# EAGLE schematic rf_test (EAGLE 5.12)

## Sheet 1 of 4
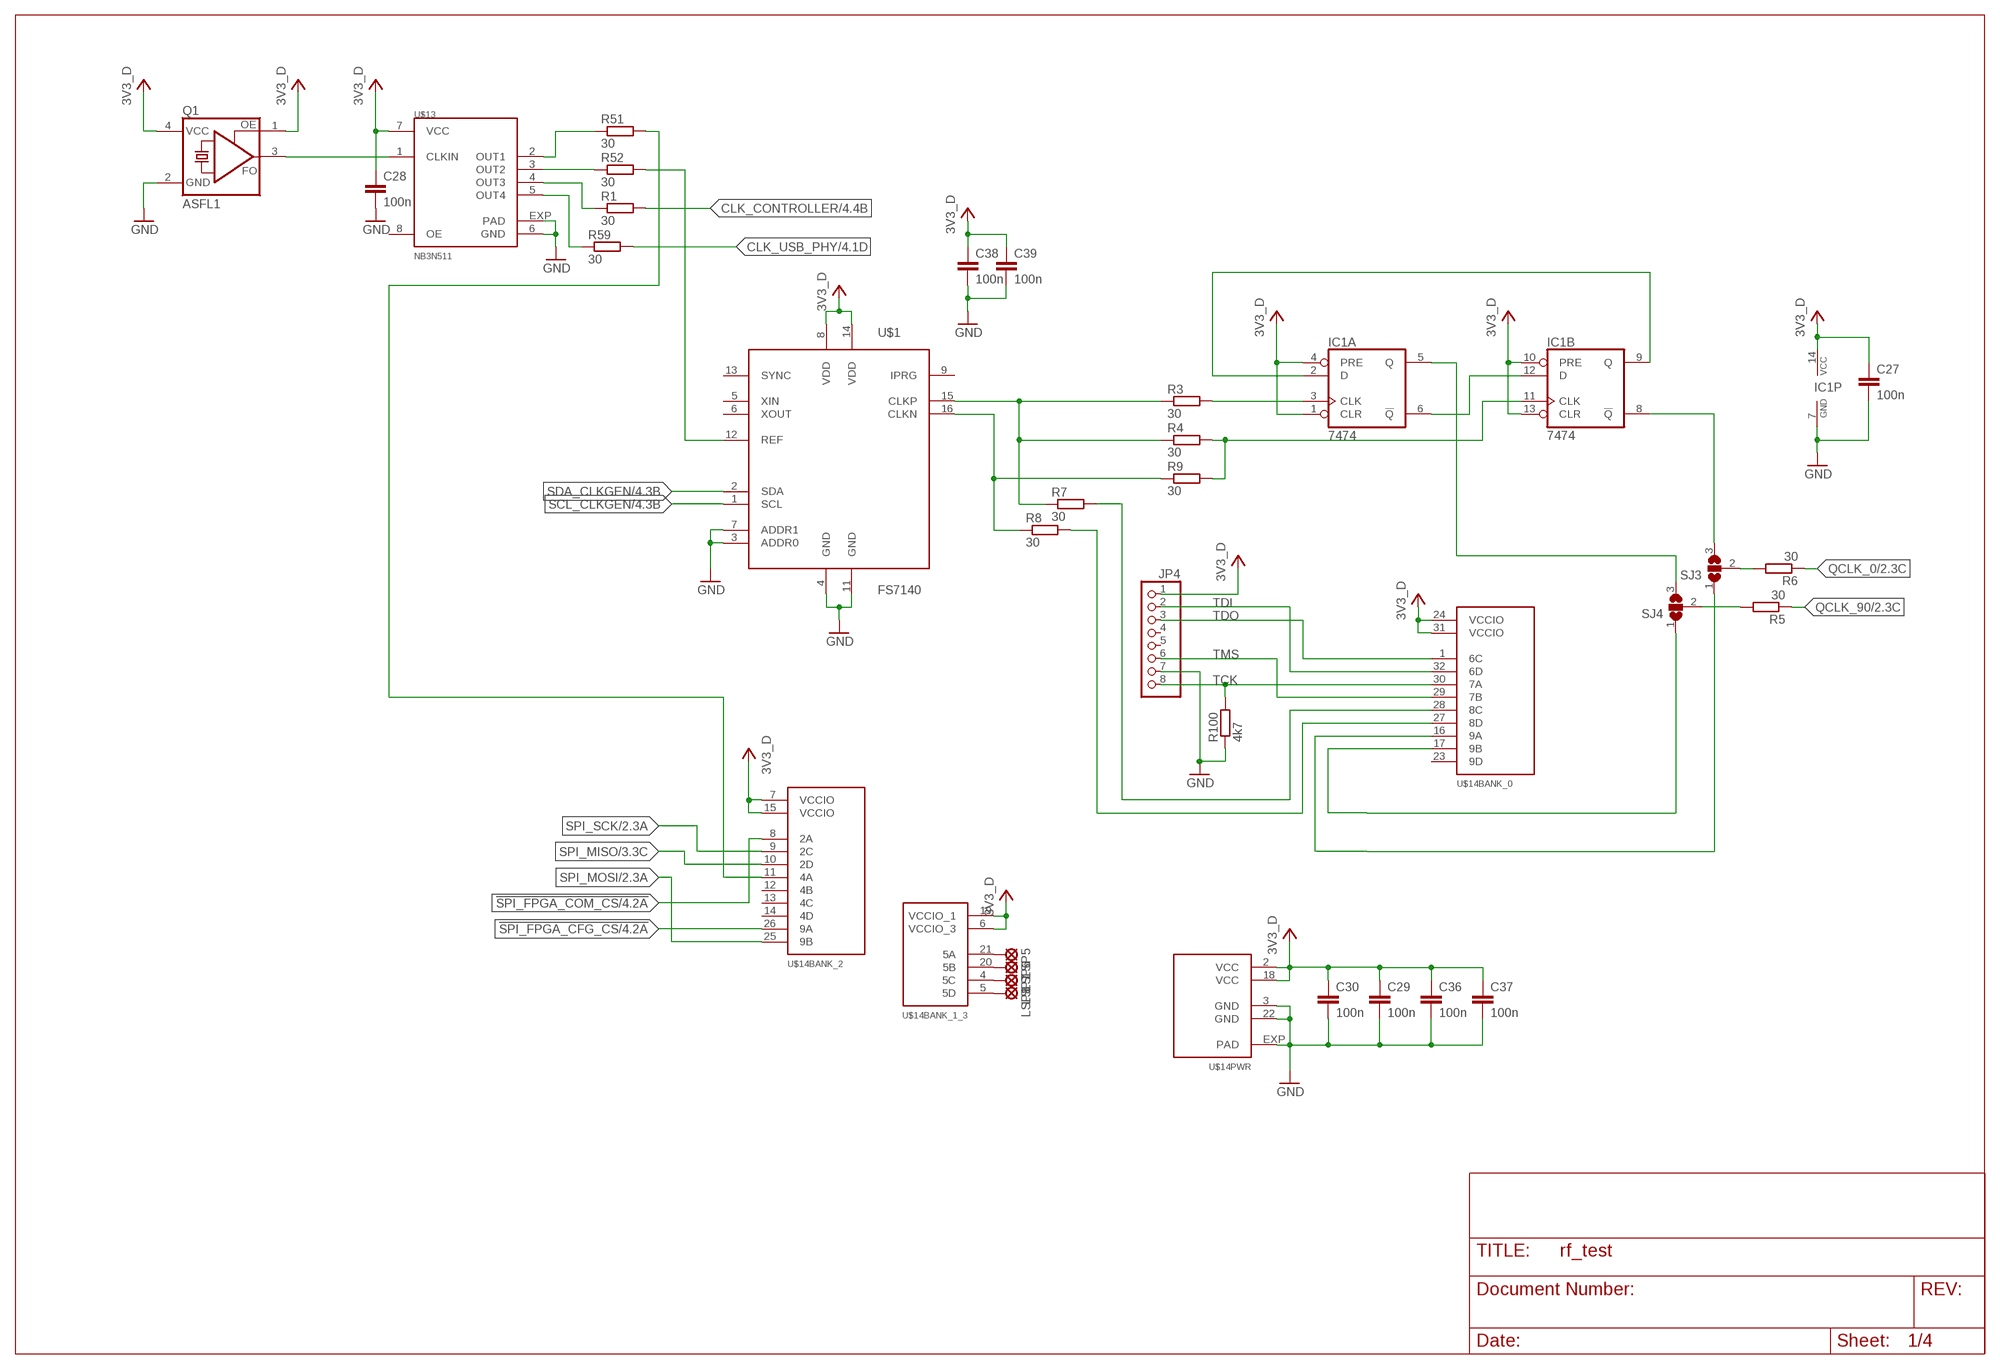
[diagram p0: schematic, sheet 1]

### Parts
C27  100n  C-EUC0402  [C0402]
C28  100n  C-EUC0402  [C0402]
C29  100n  C-EUC0402  [C0402]
C30  100n  C-EUC0402  [C0402]
C36  100n  C-EUC0402  [C0402]
C37  100n  C-EUC0402  [C0402]
C38  100n  C-EUC0402  [C0402]
C39  100n  C-EUC0402  [C0402]
IC1  7474  [TSSOP14]
JP4  PINHD-1X8  [1X08]
LSP5  LSP10  [LSP10]
LSP6  LSP10  [LSP10]
LSP7  LSP10  [LSP10]
LSP8  LSP10  [LSP10]
Q1  ASFL1  [ASEMB]
R1  30  R-EU_R0603  [R0603]
R3  30  R-EU_R0603  [R0603]
R4  30  R-EU_R0603  [R0603]
R5  30  R-EU_R0603  [R0603]
R6  30  R-EU_R0603  [R0603]
R7  30  R-EU_R0603  [R0603]
R8  30  R-EU_R0603  [R0603]
R9  30  R-EU_R0603  [R0603]
R51  30  R-EU_R0603  [R0603]
R52  30  R-EU_R0603  [R0603]
R59  30  R-EU_R0603  [R0603]
R100  4k7  R-EU_R0603  [R0603]
SJ3  SJ2W0402  [SJ_2_0402]
SJ4  SJ2W0402  [SJ_2_0402]
U$1  FS7140  [TSSOP16]
U$13  NB3N511  [DFN8-3X3]
U$14  X02_256  [HVQFN32]

### Nets
3V3_D: C27.1 C28.1 C29.1 C30.1 C36.1 C37.1 C38.1 C39.1 IC1.1(A:CLR) IC1.4(A:PRE) IC1.10(B:PRE) IC1.13(B:CLR) IC1.14(P:VCC) JP4.1 Q1.1(OE) Q1.4(VCC) U$1.8(VDD) U$1.14(VDD) U$13.7(VCC) U$14.2(PWR:VCC) U$14.6(BANK_1_3:VCCIO_3) U$14.7(BANK_2:VCCIO) U$14.15(BANK_2:VCCIO) U$14.18(PWR:VCC) U$14.19(BANK_1_3:VCCIO_1) U$14.24(BANK_0:VCCIO) U$14.31(BANK_0:VCCIO) ; also sheet 2,3,4
!SPI_FPGA_CFG_CS: U$14.26(BANK_2:9A) ; also sheet 4
!SPI_FPGA_COM_CS: U$14.8(BANK_2:2A) ; also sheet 4
CLK_CLKGEN: R52.2 U$1.12(REF)
CLK_CONTROLLER: R1.2 ; also sheet 4
CLK_OSC: Q1.3(FO) U$13.1(CLKIN)
CLK_USB_PHY: R59.2 ; also sheet 4
CLKN: R8.2 U$14.27(BANK_0:8D)
CLKN_R: R8.1 R9.1 U$1.16(CLKN)
CLKP_1: IC1.3(A:CLK) R3.2
CLKP_2: IC1.11(B:CLK) R4.2 R9.2
CLKP_3: R7.2 U$14.28(BANK_0:8C)
CLKP_R: R3.1 R4.1 R7.1 U$1.15(CLKP)
FF_FEEDBACK: IC1.2(A:D) IC1.9(B:Q)
FF_FEEDFORWARD: IC1.6(A:!Q) IC1.12(B:D)
FGA_CLK: R51.2 U$14.11(BANK_2:4A)
GND: C27.2 C28.2 C29.2 C30.2 C36.2 C37.2 C38.2 C39.2 IC1.7(P:GND) JP4.7 Q1.2(GND) R100.1 U$1.3(ADDR0) U$1.4(GND) U$1.7(ADDR1) U$1.11(GND) U$13.6(GND) U$13.EXP(PAD) U$14.3(PWR:GND) U$14.22(PWR:GND) U$14.EXP(PWR:PAD) ; also sheet 2,3,4
N$3: R6.2 SJ3.2
N$5: R5.2 SJ4.2
N$7: R1.1 U$13.4(OUT3)
N$15: R51.1 U$13.2(OUT1)
N$16: R52.1 U$13.3(OUT2)
N$25: LSP5.MP U$14.21(BANK_1_3:5A)
N$27: R59.1 U$13.5(OUT4)
N$41: LSP6.MP U$14.20(BANK_1_3:5B)
N$42: LSP7.MP U$14.4(BANK_1_3:5C)
N$43: LSP8.MP U$14.5(BANK_1_3:5D)
QCLK_0: R6.1 ; also sheet 2
QCLK_90: R5.1 ; also sheet 2
QCLK_IR_FF: IC1.5(A:Q) SJ4.3
QCLK_IR_FPGA: SJ4.1 U$14.17(BANK_0:9B)
QCLK_QR_FF: IC1.8(B:!Q) SJ3.3
QCLK_QR_FPGA: SJ3.1 U$14.16(BANK_0:9A)
SCL_CLKGEN: U$1.1(SCL) ; also sheet 4
SDA_CLKGEN: U$1.2(SDA) ; also sheet 4
SPI_MISO: U$14.10(BANK_2:2D) ; also sheet 3,4
SPI_MOSI: U$14.25(BANK_2:9B) ; also sheet 2,3,4
SPI_SCK: U$14.9(BANK_2:2C) ; also sheet 2,3,4
TCK: JP4.8 R100.2 U$14.30(BANK_0:7A)
TDI: JP4.2 U$14.32(BANK_0:6D)
TDO: JP4.3 U$14.1(BANK_0:6C)
TMS: JP4.6 U$14.29(BANK_0:7B)
Unconnected: JP4.4 JP4.5 U$1.5(XIN) U$1.6(XOUT) U$1.9(IPRG) U$1.13(SYNC) U$13.8(OE) U$14.12(BANK_2:4B) U$14.13(BANK_2:4C) U$14.14(BANK_2:4D) U$14.23(BANK_0:9D)

## Sheet 2 of 4
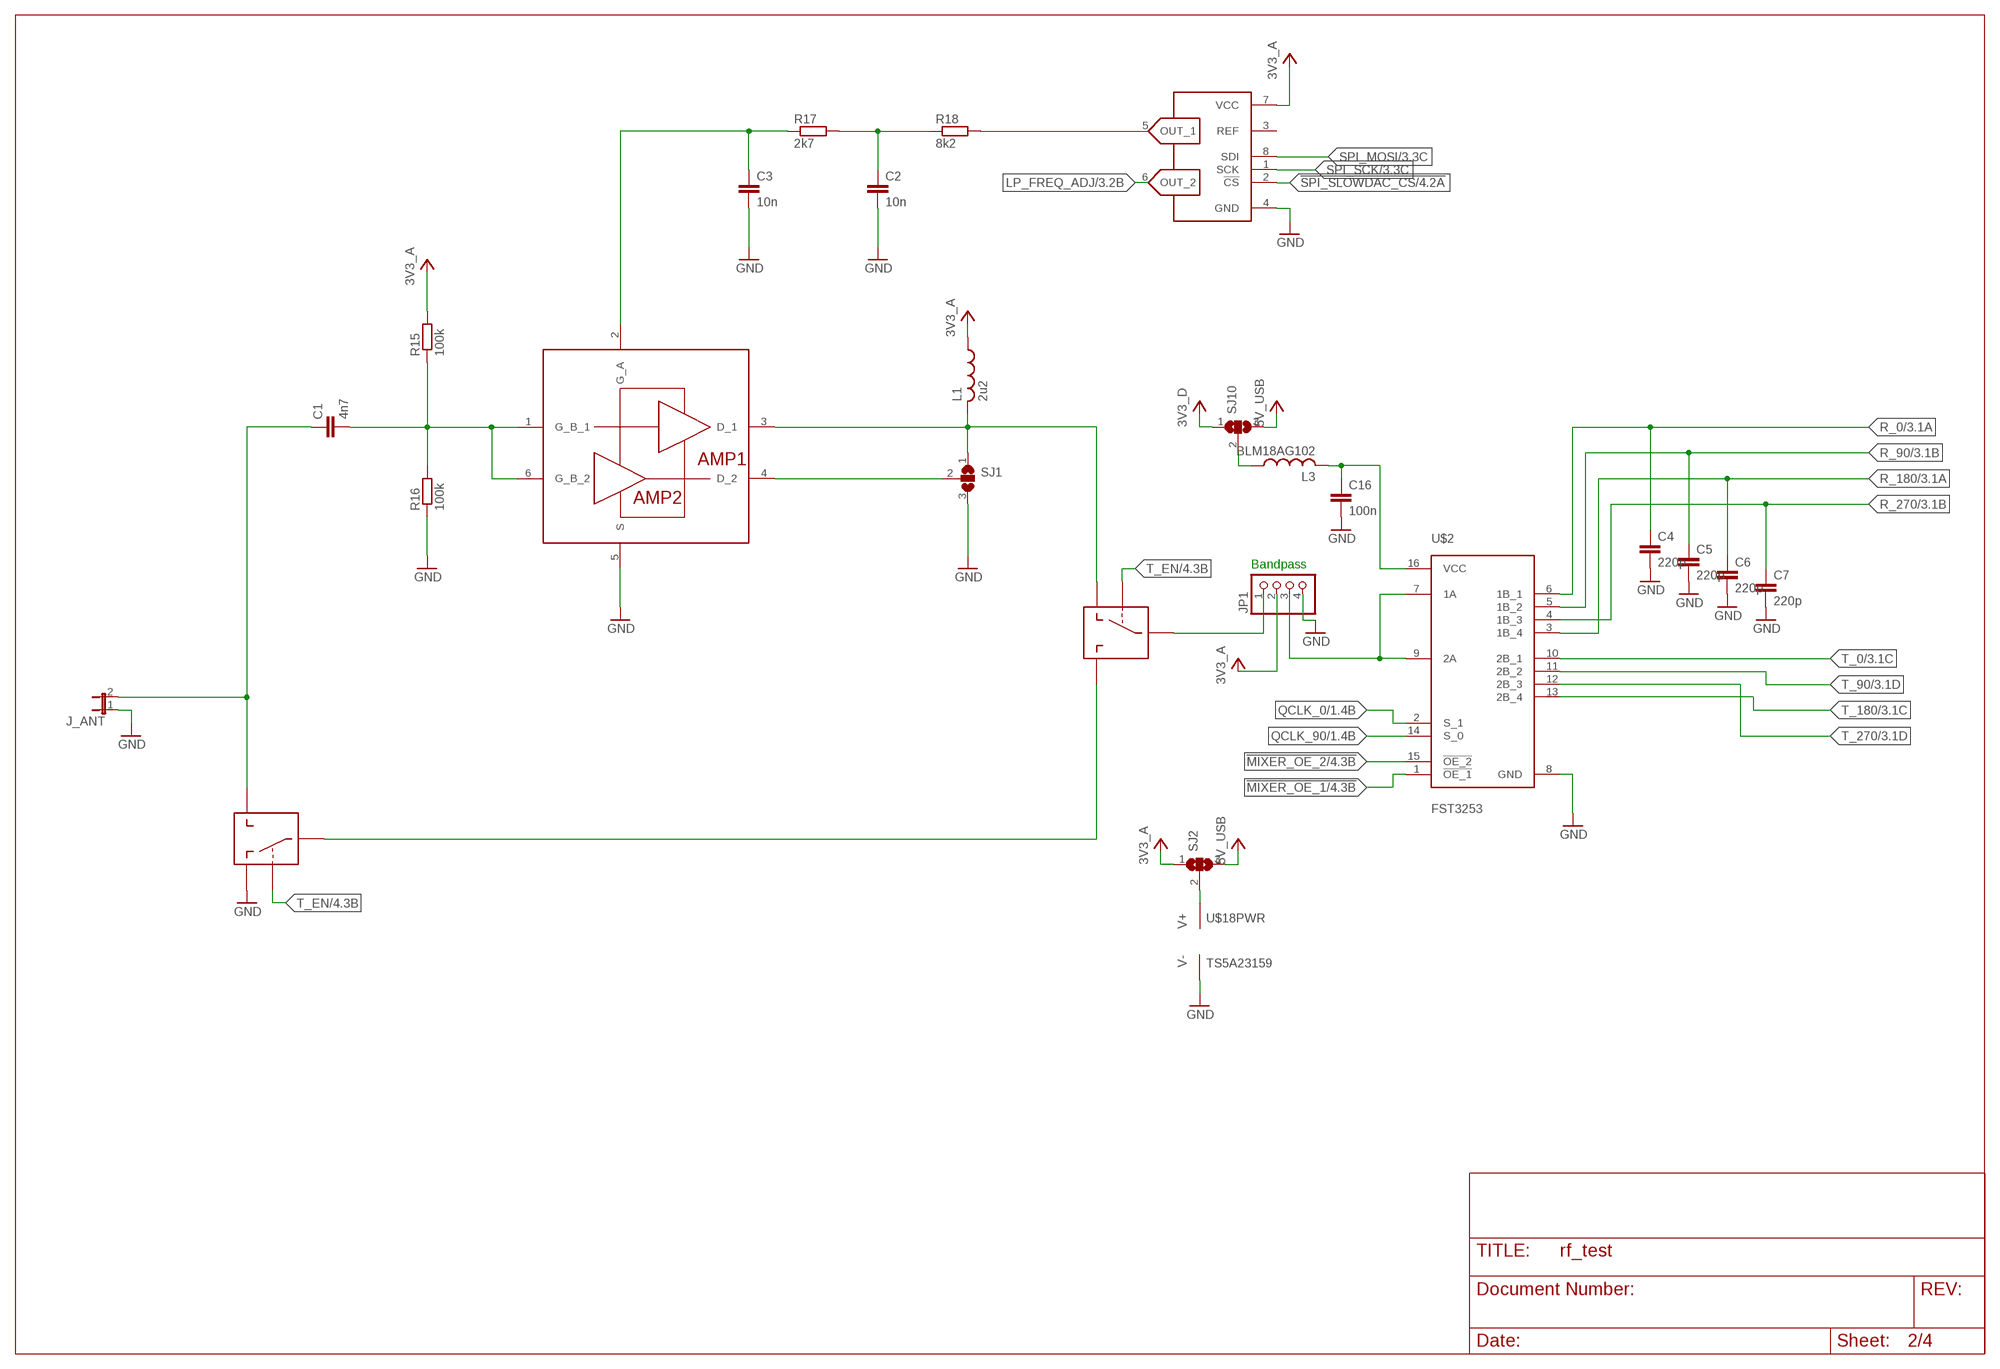
[diagram p1: schematic, sheet 2]

### Parts
C1  4n7  C-EUC0402  [C0402]
C2  10n  C-EUC0402  [C0402]
C3  10n  C-EUC0402  [C0402]
C4  220p  C-EUC0402  [C0402]
C5  220p  C-EUC0402  [C0402]
C6  220p  C-EUC0402  [C0402]
C7  220p  C-EUC0402  [C0402]
C16  100n  C-EUC0402  [C0402]
J_ANT  JP1E  [JP1]
JP1  PINHD-1X4  [1X04]
L1  2u2  L_US_1008  [L1008]
L3  BLM18AG102  L_US_BLM18  [L0603]
R15  100k  R-EU_R0603  [R0603]
R16  100k  R-EU_R0603  [R0603]
R17  2k7  R-EU_R0603  [R0603]
R18  8k2  R-EU_R0603  [R0603]
SJ1  SJ2W0402  [SJ_2_0402]
SJ2  SJ2W0402  [SJ_2_0402]
SJ10  SJ2W0402  [SJ_2_0402]
U$2  FST3253  [TSSOP16]
U$3  BF1102  [SOT363_INFINEON]
U$6  LTC2632  [TSOT23-8]
U$18  TS5A23159  [R-PUQFN-N10]

### Nets
3V3_A: JP1.2 L1.1 R15.2 SJ2.1 U$6.7(VCC) ; also sheet 3,4
3V3_D: SJ10.1 ; also sheet 1,3,4
5V_USB: SJ2.3 SJ10.3 ; also sheet 4
!MIXER_OE_1: U$2.1(!OE_1) ; also sheet 4
!MIXER_OE_2: U$2.15(!OE_2) ; also sheet 4
!SPI_SLOWDAC_CS: U$6.2(!CS) ; also sheet 4
AGC_FILTER: C2.1 R17.2 R18.1
BP_ANT: JP1.1 U$18.10(SW1:COMMON)
BP_MIXER: JP1.3 U$2.7(1A) U$2.9(2A)
GND: C2.2 C3.2 C4.2 C5.2 C6.2 C7.2 C16.2 J_ANT.1 JP1.4 R16.1 SJ1.3 U$2.8(GND) U$3.5(S) U$6.4(GND) U$18.3(PWR:GND) U$18.7(SW2:CLOSED) ; also sheet 1,3,4
LNA_G2: C3.1 R17.1 U$3.2(G_A)
LP_FREQ_ADJ: U$6.6(OUT_2) ; also sheet 3
QCLK_0: U$2.2(S_1) ; also sheet 1
QCLK_90: U$2.14(S_0) ; also sheet 1
R_0: C4.1 U$2.6(1B_1) ; also sheet 3
R_90: C5.1 U$2.5(1B_2) ; also sheet 3
R_180: C6.1 U$2.3(1B_4) ; also sheet 3
R_270: C7.1 U$2.4(1B_3) ; also sheet 3
R_AMPLIFIED: L1.2 SJ1.1 U$3.3(D_1) U$18.9(SW1:CLOSED)
R_AMPLIFIED_2: SJ1.2 U$3.4(D_2)
R_ANT: C1.1 J_ANT.2 U$18.4(SW2:OPEN)
R_ANT_AGC: C1.2 R15.1 R16.2 U$3.1(G_B_1) U$3.6(G_B_2)
SPI_MOSI: U$6.8(SDI) ; also sheet 1,3,4
SPI_SCK: U$6.1(SCK) ; also sheet 1,3,4
T_0: U$2.10(2B_1) ; also sheet 3
T_90: U$2.11(2B_2) ; also sheet 3
T_180: U$2.13(2B_4) ; also sheet 3
T_270: U$2.12(2B_3) ; also sheet 3
T_ANT: U$18.2(SW1:OPEN) U$18.6(SW2:COMMON)
T_EN: U$18.1(SW1:CTL) U$18.5(SW2:CTL) ; also sheet 4
VAGC: R18.2 U$6.5(OUT_1)
VCC_FILTER_UNFILT: L3.1 SJ10.2
VCC_MIXER_FILTERED: C16.1 L3.2 U$2.16(VCC)
VCC_RT_SWITCH: SJ2.2 U$18.8(PWR:V+)
Unconnected: U$6.3(REF)

### Notes on the sheet
- Bandpass

## Sheet 3 of 4
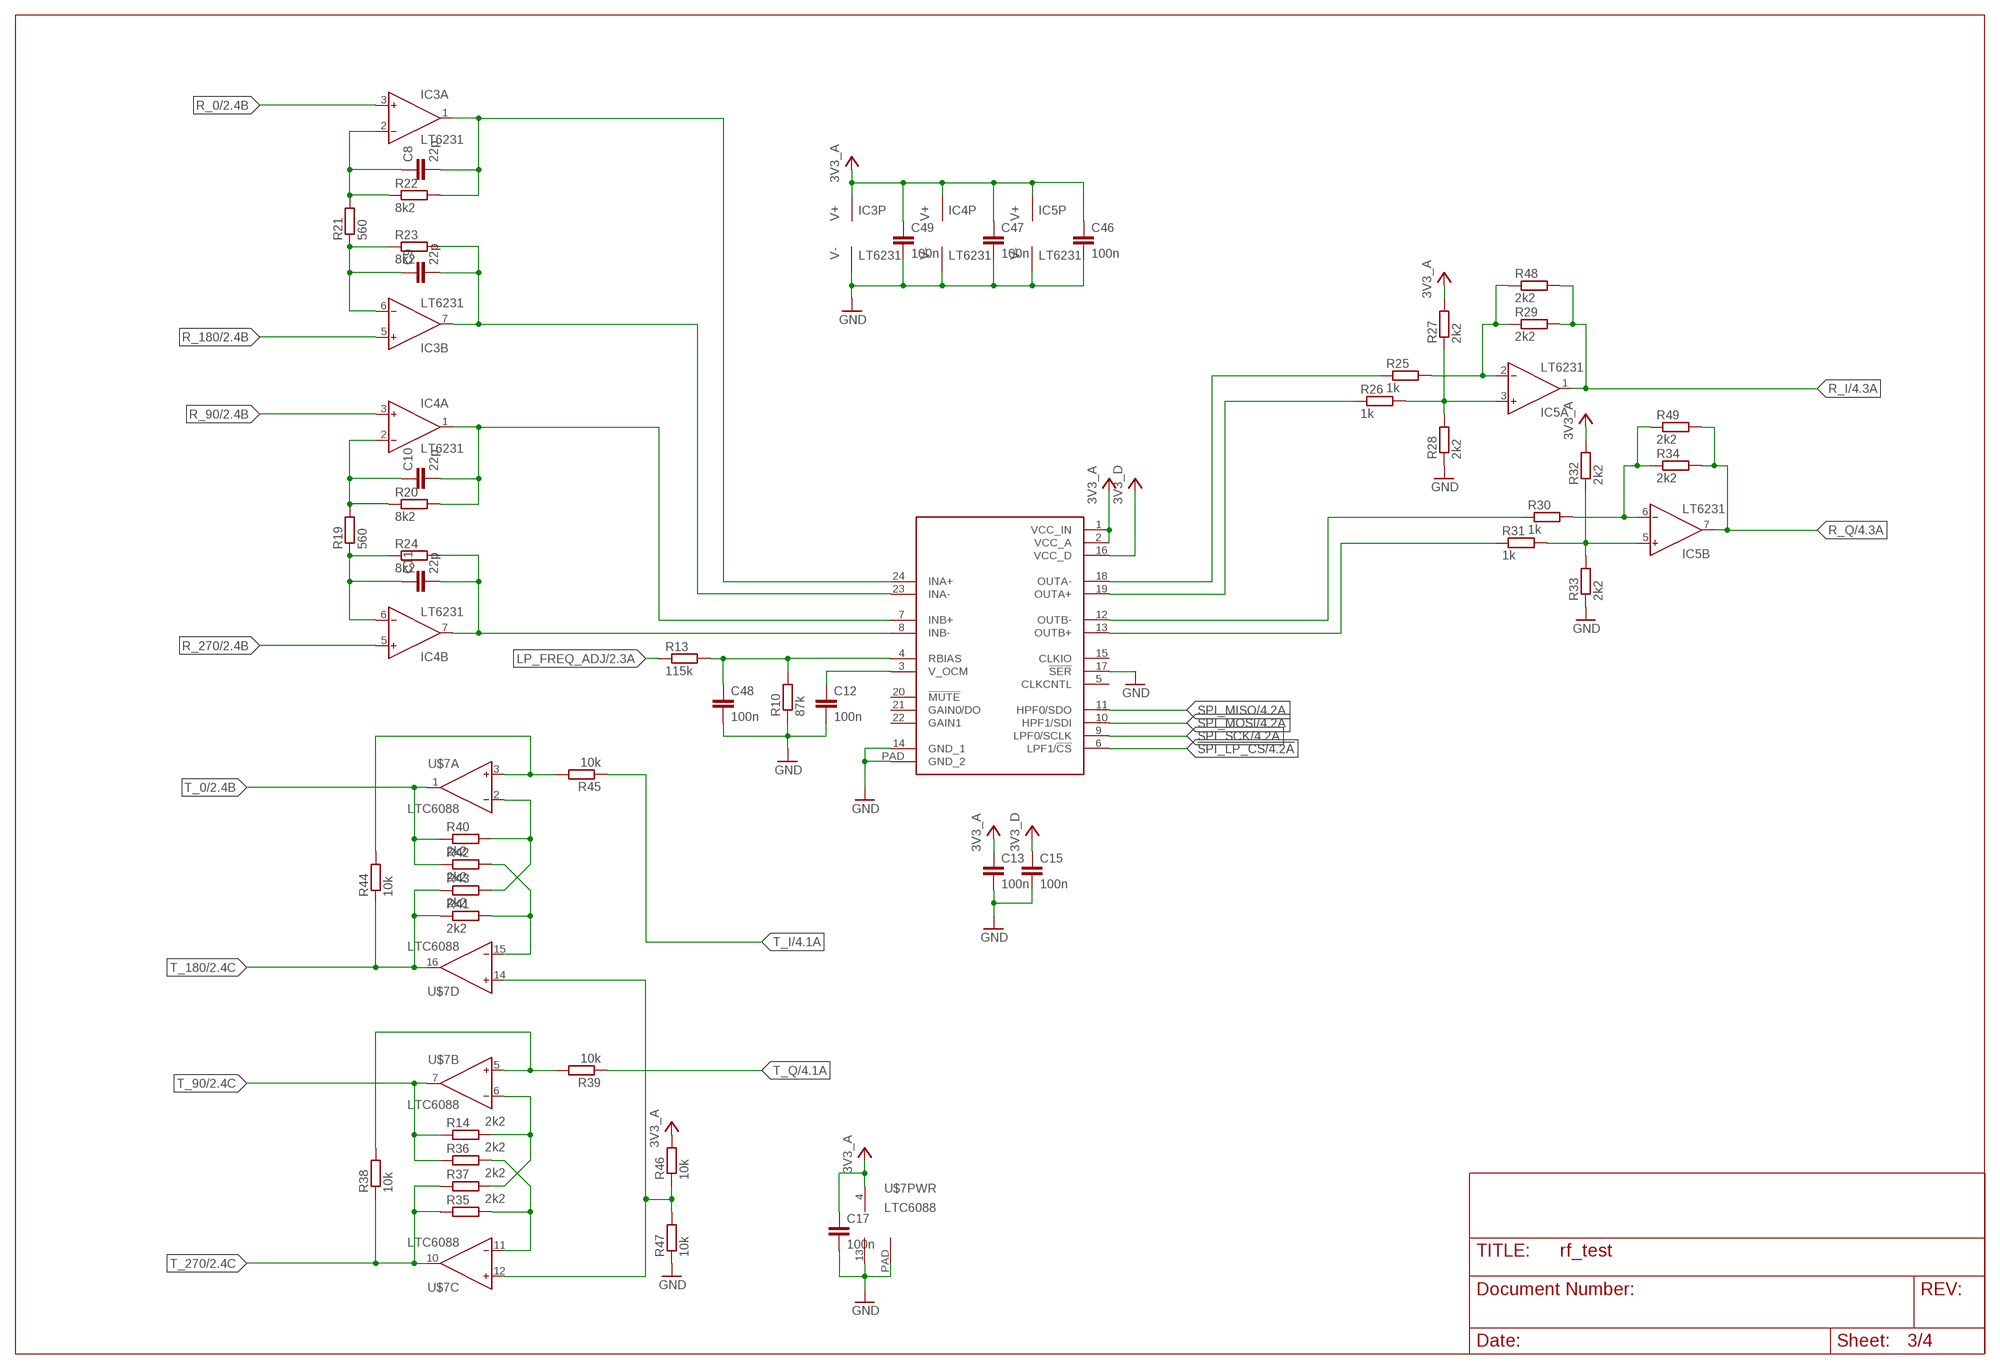
[diagram p2: schematic, sheet 3]

### Parts
C8  22p  C-EUC0402  [C0402]
C9  22p  C-EUC0402  [C0402]
C10  22p  C-EUC0402  [C0402]
C11  22p  C-EUC0402  [C0402]
C12  100n  C-EUC0402  [C0402]
C13  100n  C-EUC0402  [C0402]
C15  100n  C-EUC0402  [C0402]
C17  100n  C-EUC0402  [C0402]
C46  100n  C-EUC0402  [C0402]
C47  100n  C-EUC0402  [C0402]
C48  100n  C-EUC0402  [C0402]
C49  100n  C-EUC0402  [C0402]
IC3  LT6231  [DFN8-3X3]
IC4  LT6231  [DFN8-3X3]
IC5  LT6231  [DFN8-3X3]
R10  87k  R-EU_R0603  [R0603]
R13  115k  R-EU_R0603  [R0603]
R14  2k2  R-EU_R0603  [R0603]
R19  560  R-EU_R0603  [R0603]
R20  8k2  R-EU_R0603  [R0603]
R21  560  R-EU_R0603  [R0603]
R22  8k2  R-EU_R0603  [R0603]
R23  8k2  R-EU_R0603  [R0603]
R24  8k2  R-EU_R0603  [R0603]
R25  1k  R-EU_R0603  [R0603]
R26  1k  R-EU_R0603  [R0603]
R27  2k2  R-EU_R0603  [R0603]
R28  2k2  R-EU_R0603  [R0603]
R29  2k2  R-EU_R0603  [R0603]
R30  1k  R-EU_R0603  [R0603]
R31  1k  R-EU_R0603  [R0603]
R32  2k2  R-EU_R0603  [R0603]
R33  2k2  R-EU_R0603  [R0603]
R34  2k2  R-EU_R0603  [R0603]
R35  2k2  R-EU_R0603  [R0603]
R36  2k2  R-EU_R0603  [R0603]
R37  2k2  R-EU_R0603  [R0603]
R38  10k  R-EU_R0603  [R0603]
R39  10k  R-EU_R0603  [R0603]
R40  2k2  R-EU_R0603  [R0603]
R41  2k2  R-EU_R0603  [R0603]
R42  2k2  R-EU_R0603  [R0603]
R43  2k2  R-EU_R0603  [R0603]
R44  10k  R-EU_R0603  [R0603]
R45  10k  R-EU_R0603  [R0603]
R46  10k  R-EU_R0603  [R0603]
R47  10k  R-EU_R0603  [R0603]
R48  2k2  R-EU_R0603  [R0603]
R49  2k2  R-EU_R0603  [R0603]
U$4  LTC6602  [QFN24_4X4MM]
U$7  LTC6088  [DFN16_5X3MM]

### Nets
3V3_A: C13.1 C17.1 C46.1 C47.1 C49.1 IC3.8(P:V+) IC4.8(P:V+) IC5.8(P:V+) R27.2 R32.2 R46.2 U$4.1(VCC_IN) U$4.2(VCC_A) U$7.4(PWR:V+) ; also sheet 2,4
3V3_D: C15.1 U$4.16(VCC_D) ; also sheet 1,2,4
!SPI_LP_CS: U$4.6(LPF1/!CS) ; also sheet 4
BP_VOCM: C12.1 U$4.3(V_OCM)
GND: C12.2 C13.2 C15.2 C17.2 C46.2 C47.2 C48.2 C49.2 IC3.4(P:GND) IC4.4(P:GND) IC5.4(P:GND) R10.1 R28.1 R33.1 R47.1 U$4.14(GND_1) U$4.17(!SER) U$4.PAD(GND_2) U$7.13(PWR:V-) U$7.PAD(PWR:PAD) ; also sheet 1,2,4
I_BIAS: IC5.3(A:IN+) R26.2 R27.1 R28.2
I_FEEDBACK: IC5.2(A:IN-) R25.2 R29.1 R48.1
I_NEG: C9.2 IC3.7(B:OUT) R23.2 U$4.23(INA-)
I_NEG_FEEDBACK: C9.1 IC3.6(B:IN-) R21.1 R23.1
I_NEG_FILTERED: R26.1 U$4.19(OUTA+)
I_POS: C8.2 IC3.1(A:OUT) R22.2 U$4.24(INA+)
I_POS_FEEDACK: C8.1 IC3.2(A:IN-) R21.2 R22.1
I_POS_FILTERED: R25.1 U$4.18(OUTA-)
LP_FREQ_ADJ: R13.1 ; also sheet 2
LP_RBIAS: C48.1 R10.2 R13.2 U$4.4(RBIAS)
N$4: R38.2 R39.2 U$7.5(B:IN+)
N$13: R14.2 R37.2 U$7.6(B:IN-)
N$17: R35.2 R36.2 U$7.11(C:IN-)
N$18: R40.2 R43.2 U$7.2(A:IN-)
N$21: R41.2 R42.2 U$7.15(D:IN-)
N$100: R44.2 R45.2 U$7.3(A:IN+)
Q_BIAS: IC5.5(B:IN+) R31.2 R32.1 R33.2
Q_FEEDBACK: IC5.6(B:IN-) R30.2 R34.1 R49.1
Q_NEG: C11.2 IC4.7(B:OUT) R24.2 U$4.8(INB-)
Q_NEG_FEEDBACK: C11.1 IC4.6(B:IN-) R19.1 R24.1
Q_NEG_FILTERD: R31.1 U$4.13(OUTB+)
Q_POS: C10.2 IC4.1(A:OUT) R20.2 U$4.7(INB+)
Q_POS_FEEDBACK: C10.1 IC4.2(A:IN-) R19.2 R20.1
Q_POS_FILTERED: R30.1 U$4.12(OUTB-)
R_0: IC3.3(A:IN+) ; also sheet 2
R_90: IC4.3(A:IN+) ; also sheet 2
R_180: IC3.5(B:IN+) ; also sheet 2
R_270: IC4.5(B:IN+) ; also sheet 2
R_I: IC5.1(A:OUT) R29.2 R48.2 ; also sheet 4
R_Q: IC5.7(B:OUT) R34.2 R49.2 ; also sheet 4
SPI_MISO: U$4.11(HPF0/SDO) ; also sheet 1,4
SPI_MOSI: U$4.10(HPF1/SDI) ; also sheet 1,2,4
SPI_SCK: U$4.9(LPF0/SCLK) ; also sheet 1,2,4
T_0: R40.1 R42.1 U$7.1(A:OUT) ; also sheet 2
T_90: R14.1 R36.1 U$7.7(B:OUT) ; also sheet 2
T_180: R41.1 R43.1 R44.1 U$7.16(D:OUT) ; also sheet 2
T_270: R35.1 R37.1 R38.1 U$7.10(C:OUT) ; also sheet 2
T_CM: R46.1 R47.2 U$7.12(C:IN+) U$7.14(D:IN+)
T_I: R45.1 ; also sheet 4
T_Q: R39.1 ; also sheet 4
Unconnected: U$4.5(CLKCNTL) U$4.15(CLKIO) U$4.20(!MUTE) U$4.21(GAIN0/DO) U$4.22(GAIN1)

## Sheet 4 of 4
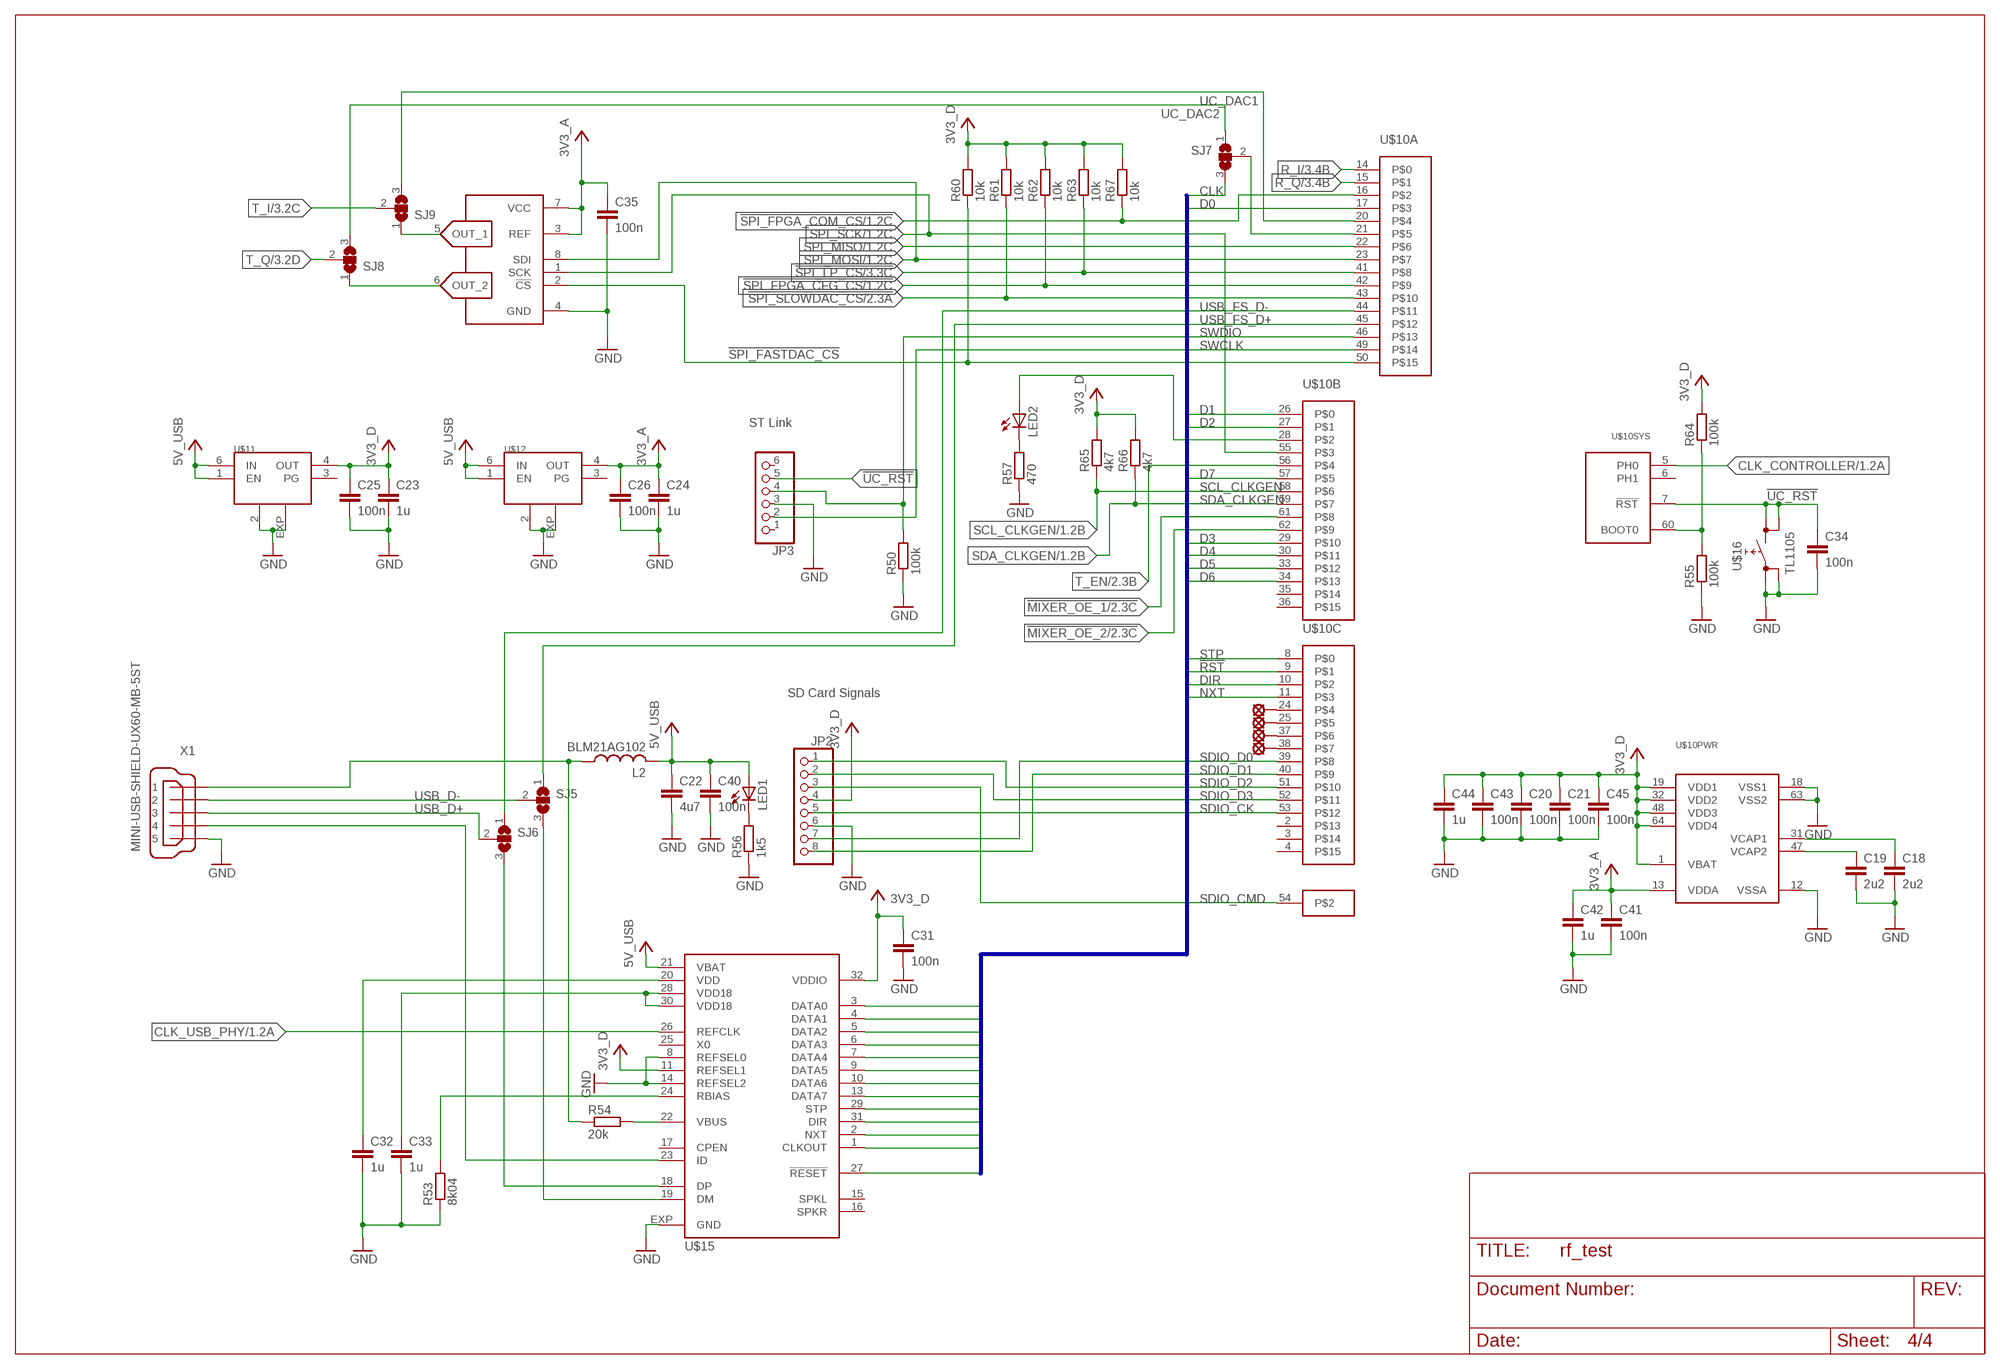
[diagram p3: schematic, sheet 4]

### Parts
C18  2u2  C-EUC0402  [C0402]
C19  2u2  C-EUC0402  [C0402]
C20  100n  C-EUC0402  [C0402]
C21  100n  C-EUC0402  [C0402]
C22  4u7  C-EUC0402  [C0402]
C23  1u  C-EUC0402  [C0402]
C24  1u  C-EUC0402  [C0402]
C25  100n  C-EUC0402  [C0402]
C26  100n  C-EUC0402  [C0402]
C31  100n  C-EUC0402  [C0402]
C32  1u  C-EUC0402  [C0402]
C33  1u  C-EUC0402  [C0402]
C34  100n  C-EUC0402  [C0402]
C35  100n  C-EUC0402  [C0402]
C40  100n  C-EUC0402  [C0402]
C41  100n  C-EUC0402  [C0402]
C42  1u  C-EUC0402  [C0402]
C43  100n  C-EUC0402  [C0402]
C44  1u  C-EUC0402  [C0402]
C45  100n  C-EUC0402  [C0402]
JP2  PINHD-1X8  [1X08]
JP3  PINHD-1X6  [1X06]
L2  BLM21AG102  L_US_BLM21  [L0805]
LED1  LEDCHIP-LED0603  [CHIP-LED0603]
LED2  LEDCHIP-LED0603  [CHIP-LED0603]
LSP1  LSP10  [LSP10]
LSP2  LSP10  [LSP10]
LSP3  LSP10  [LSP10]
LSP4  LSP10  [LSP10]
R50  100k  R-EU_R0603  [R0603]
R53  8k04  R-EU_R0603  [R0603]
R54  20k  R-EU_R0603  [R0603]
R55  100k  R-EU_R0603  [R0603]
R56  1k5  R-EU_R0603  [R0603]
R57  470  R-EU_R0603  [R0603]
R60  10k  R-EU_R0603  [R0603]
R61  10k  R-EU_R0603  [R0603]
R62  10k  R-EU_R0603  [R0603]
R63  10k  R-EU_R0603  [R0603]
R64  100k  R-EU_R0603  [R0603]
R65  4k7  R-EU_R0603  [R0603]
R66  4k7  R-EU_R0603  [R0603]
R67  10k  R-EU_R0603  [R0603]
SJ5  SJ2W0402  [SJ_2_0402]
SJ6  SJ2W0402  [SJ_2_0402]
SJ7  SJ2W0402  [SJ_2_0402]
SJ8  SJ2W0402  [SJ_2_0402]
SJ9  SJ2W0402  [SJ_2_0402]
U$10  STM32F4_64  [LQFP-ST-64-2]
U$11  LD39050  [DFN6-3X3]
U$12  LD39050  [DFN6-3X3]
U$15  USB3340  [HVQFN32]
U$16  TL1105  [TL1105]
U$17  LTC2632  [TSOT23-8]
X1  MINI-USB-SHIELD-UX60-MB-5ST  [UX60-MB-5ST]

### Nets
3V3_A: C24.1 C26.1 C35.1 C41.1 C42.1 U$10.13(PWR:VDDA) U$12.4(OUT) U$17.3(REF) U$17.7(VCC) ; also sheet 2,3
3V3_D: C20.1 C21.1 C23.1 C25.1 C31.1 C43.1 C44.1 C45.1 JP2.4 R60.2 R61.2 R62.2 R63.2 R64.2 R65.2 R66.2 R67.2 U$10.1(PWR:VBAT) U$10.19(PWR:VDD1) U$10.32(PWR:VDD2) U$10.48(PWR:VDD3) U$10.64(PWR:VDD4) U$11.4(OUT) U$15.11(REFSEL1) U$15.32(VDDIO) ; also sheet 1,2,3
5V_USB: C22.1 C40.1 L2.2 LED1.A U$11.1(EN) U$11.6(IN) U$12.1(EN) U$12.6(IN) U$15.21(VBAT) ; also sheet 2
5V_USB_UNFILTERED: L2.1 R54.1 X1.1
!MIXER_OE_1: U$10.61 ; also sheet 2
!MIXER_OE_2: U$10.62 ; also sheet 2
!RST: U$10.9 U$15.27(!RESET)
!SPI_FASTDAC_CS: R60.1 U$10.50 U$17.2(!CS)
!SPI_FPGA_CFG_CS: R62.1 U$10.42 ; also sheet 1
!SPI_FPGA_COM_CS: R67.1 U$10.16 ; also sheet 1
!SPI_LP_CS: R63.1 U$10.41 ; also sheet 3
!SPI_SLOWDAC_CS: R61.1 U$10.43 ; also sheet 2
!UC_RST: C34.1 JP3.5 U$10.7(SYS:!RST) U$16.3(2A) U$16.4(2B)
BOOT0: R55.2 R64.1 U$10.60(SYS:BOOT0)
CLK: SJ7.3 U$15.1(CLKOUT)
CLK_CONTROLLER: U$10.5(SYS:PH0) ; also sheet 1
CLK_USB_PHY: U$15.26(REFCLK) ; also sheet 1
D0: U$10.17 U$15.3(DATA0)
D1: U$10.26 U$15.4(DATA1)
D2: U$10.27 U$15.5(DATA2)
D3: U$10.29 U$15.6(DATA3)
D4: U$10.30 U$15.7(DATA4)
D5: U$10.33 U$15.9(DATA5)
D6: U$10.34 U$15.10(DATA6)
D7: U$10.57 U$15.13(DATA7)
DIR: U$10.10 U$15.31(DIR)
GND: C18.2 C19.2 C20.2 C21.2 C22.2 C23.2 C24.2 C25.2 C26.2 C31.2 C32.2 C33.2 C34.2 C35.2 C40.2 C41.2 C42.2 C43.2 C44.2 C45.2 JP2.6 JP3.3 R50.1 R53.1 R55.1 R56.1 R57.1 U$10.12(PWR:VSSA) U$10.18(PWR:VSS1) U$10.63(PWR:VSS2) U$11.2(GND) U$11.EXP(PAD) U$12.2(GND) U$12.EXP(PAD) U$15.8(REFSEL0) U$15.14(REFSEL2) U$15.EXP(GND) U$16.1(1A) U$16.2(1B) U$17.4(GND) X1.5 ; also sheet 1,2,3
N$12: LSP1.MP U$10.24
N$14: LSP2.MP U$10.25
N$26: LSP3.MP U$10.37
N$28: SJ7.2 U$10.21
N$31: R53.2 U$15.24(RBIAS)
N$36: SJ9.1 U$17.5(OUT_1)
N$37: SJ8.1 U$17.6(OUT_2)
N$38: LED1.C R56.2
N$39: LED2.C R57.2
N$40: LSP4.MP U$10.38
NXT: U$10.11 U$15.2(NXT)
PHY_VBUS: R54.2 U$15.22(VBUS)
PHY_VDD: C32.1 U$15.20(VDD)
PHY_VDD18: C33.1 U$15.28(VDD18) U$15.30(VDD18)
R_I: U$10.14 ; also sheet 3
R_Q: U$10.15 ; also sheet 3
SCL_CLKGEN: R65.1 U$10.58 ; also sheet 1
SDA_CLKGEN: R66.1 U$10.59 ; also sheet 1
SDIO_CK: JP2.5 U$10.53
SDIO_CMD: JP2.3 U$10.54
SDIO_D0: JP2.7 U$10.39
SDIO_D1: JP2.8 U$10.40
SDIO_D2: JP2.1 U$10.51
SDIO_D3: JP2.2 U$10.52
SPI_MISO: U$10.22 ; also sheet 1,3
SPI_MOSI: U$10.23 U$17.8(SDI) ; also sheet 1,2,3
SPI_SCK: U$10.55 U$17.1(SCK) ; also sheet 1,2,3
STP: U$10.8 U$15.29(STP)
SWCLK: JP3.2 U$10.49
SWDIO: JP3.4 R50.2 U$10.46
T_EN: U$10.56 ; also sheet 2
T_I: SJ9.2 ; also sheet 3
T_Q: SJ8.2 ; also sheet 3
UC_DAC1: SJ9.3 U$10.20
UC_DAC2: SJ7.1 SJ8.3
UC_LED: LED2.A U$10.28
USB_D+: SJ6.2 X1.3
USB_D-: SJ5.2 X1.2
USB_FS_D+: SJ5.1 U$10.45
USB_FS_D-: SJ6.1 U$10.44
USB_HS_D+: SJ6.3 U$15.18(DP)
USB_HS_D-: SJ5.3 U$15.19(DM)
USB_ID: U$15.23(ID) X1.4
VCAP1: C18.1 U$10.31(PWR:VCAP1)
VCAP2: C19.1 U$10.47(PWR:VCAP2)
Unconnected: JP3.1 JP3.6 U$10.2 U$10.3 U$10.4 U$10.6(SYS:PH1) U$10.35 U$10.36 U$11.3(PG) U$12.3(PG) U$15.15(SPKL) U$15.16(SPKR) U$15.17(CPEN) U$15.25(X0) X1.M1(S1) X1.M2(S2) X1.M3(S3) X1.M4(S4)

### Buses
ULPI:D[0..7],CLK,STP,NXT,DIR,!RST

### Notes on the sheet
- ST Link
- SD Card Signals

## Library data of the parts
C1-C13 C15-C49 = rcl:C-EU: CAPACITOR, European symbol
IC1 = clock:74*74: Dual D type positive edge triggered FLIP FLOP, preset and clear
IC3-IC5 = analog:LT6231
J_ANT = jumper:JP1E: JUMPER
JP1 = pinhead:PINHD-1X4: PIN HEADER
JP2 JP4 = pinhead:PINHD-1X8: PIN HEADER
JP3 = pinhead:PINHD-1X6: PIN HEADER
L1-L3 = analog:L_US: L1008 Coilcraft 1008
LED1 LED2 = led:LED: LED OSRAM: - CHIPLED LG R971, LG N971, LY N971, LG Q971, LY Q971, LO R971, LY R971 LH N974, LH R974 LS Q976, LO Q976, LY Q976 LO Q996 - Hyper CHIPLED LW Q18S LB Q993, LB Q99A, LB R99A - SideLED LS A670, LO A670, LY A670, LG A670, LP A670 LB A673, LV A673, LT A673, LW A673 LH A674 LY A675 LS A676, LA A676, LO A676, LY A676, LW A676 LS A679, LY A679, LG A679 - Hyper Micro SIDELED® LS Y876, LA Y876, LO Y876, LY Y876 LT Y87S - SmartLED LW L88C, LW L88S LB L89C, LB L89S, LG L890 LS L89K, LO L89K, LY L89K LS L896, LA L896, LO L896, LY L896 - TOPLED LS T670, LO T670, LY T670, LG T670, LP T670 LSG T670, LSP T670, LSY T670, LOP T670, LYG T670 LG T671, LOG T671, LSG T671 LB T673, LV T673, LT T673, LW T673 LH T674 LS T676, LA T676, LO T676, LY T676, LB T676, LH T676, LSB T676, LW T676 LB T67C, LV T67C, LT T67C, LS T67K, LO T67K, LY T67K, LW E67C LS E67B, LA E67B, LO E67B, LY E67B, LB E67C, LV E67C, LT E67C LW T67C LS T679, LY T679, LG T679 LS T770, LO T770, LY T770, LG T770, LP T770 LB T773, LV T773, LT T773, LW T773 LH T774 LS E675, LA E675, LY E675, LS T675 LS T776, LA T776, LO T776, LY T776, LB T776 LHGB T686 LT T68C, LB T68C - Hyper Mini TOPLED® LB M676 - Mini TOPLED Santana® LG M470 LS M47K, LO M47K, LY M47K Source: http://www.osram.convergy.de LUXEON: - LUMILED® LXK2-PW12-R00, LXK2-PW12-S00, LXK2-PW14-U00, LXK2-PW14-V00 LXK2-PM12-R00, LXK2-PM12-S00, LXK2-PM14-U00 LXK2-PE12-Q00, LXK2-PE12-R00, LXK2-PE12-S00, LXK2-PE14-T00, LXK2-PE14-U00 LXK2-PB12-K00, LXK2-PB12-L00, LXK2-PB12-M00, LXK2-PB14-N00, LXK2-PB14-P00, LXK2-PB14-Q00 LXK2-PR12-L00, LXK2-PR12-M00, LXK2-PR14-Q00, LXK2-PR14-R00 LXK2-PD12-Q00, LXK2-PD12-R00, LXK2-PD12-S00 LXK2-PH12-R00, LXK2-PH12-S00 LXK2-PL12-P00, LXK2-PL12-Q00, LXK2-PL12-R00 Source: www.luxeon.com KINGBRIGHT: KA-3528ASYC Source: www.kingbright.com
LSP1-LSP8 = solpad:LSP10: SOLDER PAD drill 1.0 mm, distributor Buerklin, 12H555
Q1 = clock:ASF*: CRYSTAL CLOCK OSCILLATORS 5.0 Vdc or 3.3 Vdc - LOW PROFILE ULTRA MINIATURE CERAMIC SURFACE MOUNT Source: http://www.abracon.com/Oscillators/asf1-L-L1.pdf http://www.abracon.com/Oscillators/ASEMB.pdf
R1 R3-R10 R13-R57 R59-R67 R100 = rcl:R-EU_: RESISTOR, European symbol
SJ1-SJ10 = util:SJ2W: SMD solder JUMPER
U$1 = clock:FS7140
U$2 = clock:FST3253
U$3 = analog:BF1102
U$4 = analog:LTC6602
U$6 U$17 = analog:LTC2632
U$7 = analog:LTC6088
U$10 = controller:STM32F4_64
U$11 U$12 = controller:LD39050
U$13 = clock:NB3N511
U$14 = controller:X02_256
U$15 = controller:USB3340
U$16 = controller:TL1105
U$18 = analog:TS5A23159: TS5A23159 Dual SPDT Analog Switch
X1 = controller:MINI-USB-SHIELD-: MINI USB Connector Source: http://www.hirose.co.jp/cataloge_hp/e24000019.pdf; OC_FARNELL: unknown; OC_NEWARK: unknown